# Altium schematic sheet 8-PORT.SchDoc: RD15002_SingleSCT.PrjPcb
size A4; DrawnBy: 邓勇杰; Revision: A1.0.0; SheetNumber: 9; SheetTotal: 10; Time: 2015/12/2
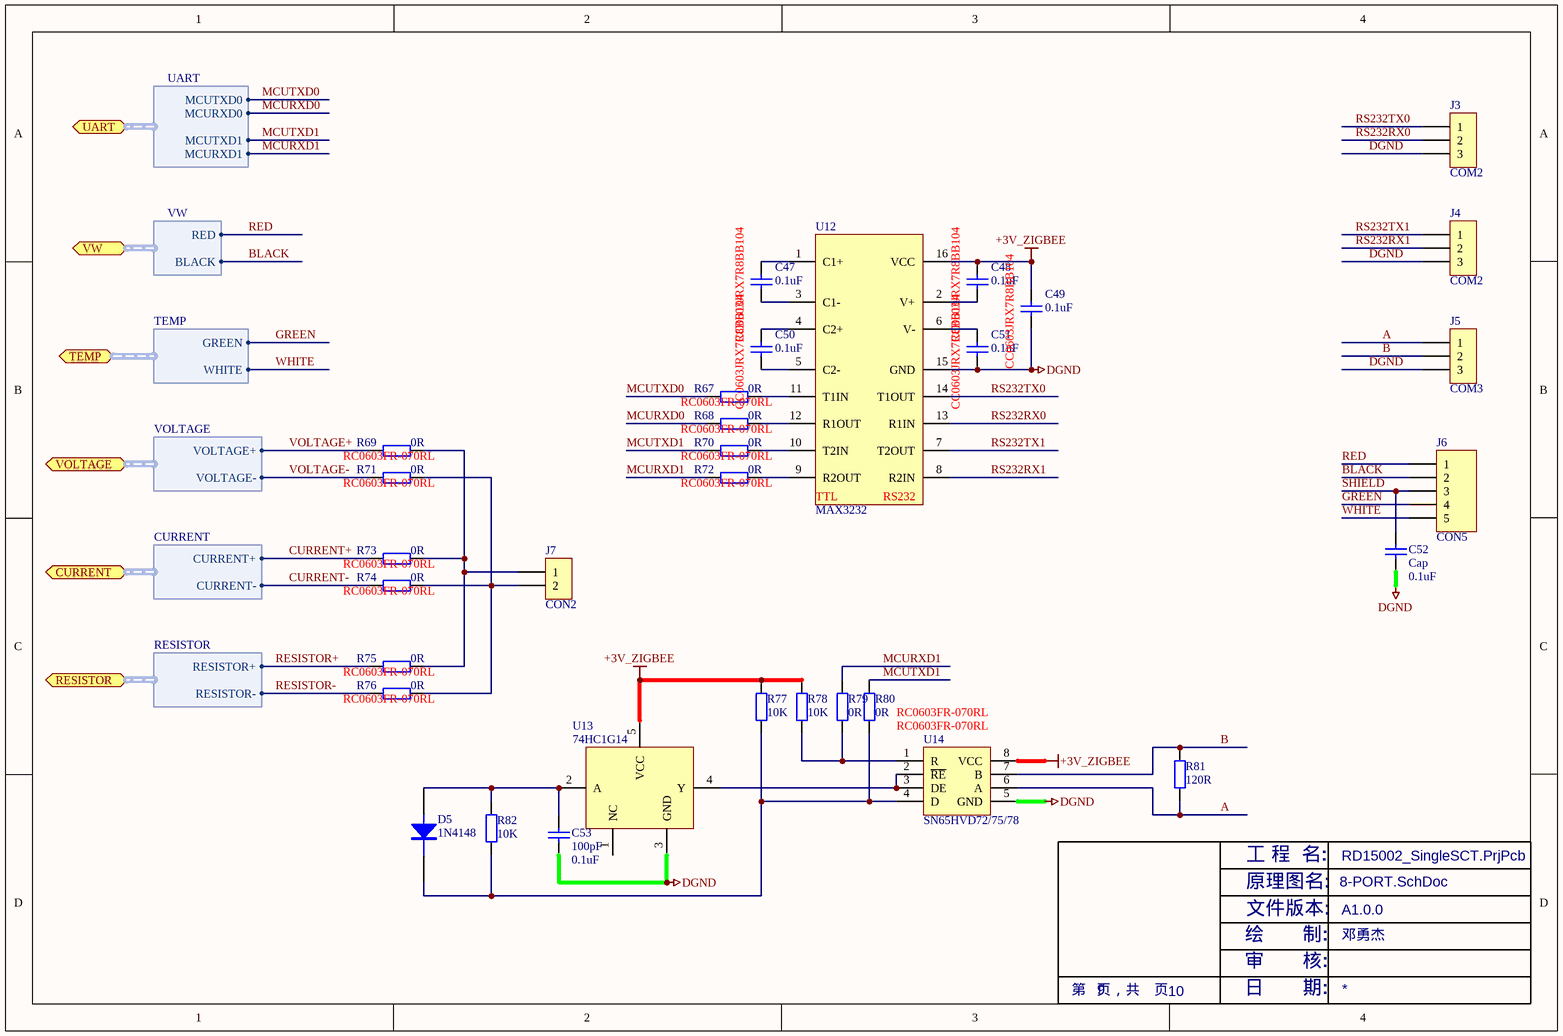
[diagram p0: 8-PORT.SchDoc]

## Parts
C47  0.1uF  Type No.: CC0603JRX7R8BB104  [CC0603]
C48  0.1uF  Type No.: CC0603JRX7R8BB104  [CC0603]
C49  0.1uF  Type No.: CC0603JRX7R8BB104  [CC0603]
C50  0.1uF  Type No.: CC0603JRX7R8BB104  [CC0603]
C51  0.1uF  Type No.: CC0603JRX7R8BB104  [CC0603]
C52  Cap  value 0.1uF  [CC0603]
C53  100pF  value 0.1uF  [CC0603]
D5  1N4148  [SOD323]
J3  COM2  [ECH350H-3P]
J4  COM2  [ECH350H-3P]
J5  COM3  [ECH350H-3P]
J6  CON5  [ECH350H-5P]
J7  CON2  [ECH350H-2P]
R67  0R  Type No.: RC0603FR-070RL  [CC0603]
R68  0R  Type No.: RC0603FR-070RL  [CC0603]
R69  0R  Type No.: RC0603FR-070RL  [CC0603]
R70  0R  Type No.: RC0603FR-070RL  [CC0603]
R71  0R  Type No.: RC0603FR-070RL  [CC0603]
R72  0R  Type No.: RC0603FR-070RL  [CC0603]
R73  0R  Type No.: RC0603FR-070RL  [CC0603]
R74  0R  Type No.: RC0603FR-070RL  [CC0603]
R75  0R  Type No.: RC0603FR-070RL  [CC0603]
R76  0R  Type No.: RC0603FR-070RL  [CC0603]
R77  10K  [CC0603]
R78  10K  [CC0603]
R79  0R  Type No.: RC0603FR-070RL  [CC0603]
R80  0R  Type No.: RC0603FR-070RL  [CC0603]
R81  120R  [CC0603]
R82  10K  [CC0603]
U12  MAX3232  [SO-16]
U13  74HC1G14  [SOT-23-5]
U14  SN65HVD72/75/78  [SO-8]

## Ports
CURRENT (harness CURRENT), RESISTOR (harness RESISTOR), TEMP (harness TEMP), UART (harness UART), VOLTAGE (harness VOLTAGE), VW (harness VW)

## Harnesses
UART: MCUTXD0, MCUTXD1, MCURXD0, MCURXD1
VW: RED, BLACK
TEMP: GREEN, WHITE
VOLTAGE: VOLTAGE+, VOLTAGE-
CURRENT: CURRENT+, CURRENT-
RESISTOR: RESISTOR+, RESISTOR-

## Nets
+3V_ZIGBEE: C48.2 C49.2 R77.2 R78.1 U12.16(VCC) U13.5(VCC) U14.8(VCC)
DGND: C49.1 C51.1 C52.1 C53.1 J3.3 J4.3 J5.3 U12.15(GND) U13.3(GND) U14.5(GND)
A: J5.1 R81.1 U14.6(A)
B: J5.2 R81.2 U14.7(B)
BLACK: J6.2 ; port VW.BLACK
CURRENT+: R73.2 ; port CURRENT.CURRENT+
CURRENT-: R74.2 ; port CURRENT.CURRENT-
GREEN: J6.4 ; port TEMP.GREEN
MCURXD0: R68.2 ; port UART.MCURXD0
MCURXD1: R72.2 R79.1 ; port UART.MCURXD1
MCUTXD0: R67.2 ; port UART.MCUTXD0
MCUTXD1: R70.2 R80.1 ; port UART.MCUTXD1
RED: J6.1 ; port VW.RED
RESISTOR+: R75.2 ; port RESISTOR.RESISTOR+
RESISTOR-: R76.2 ; port RESISTOR.RESISTOR-
RS232RX0: J3.2 U12.13(R1IN)
RS232RX1: J4.2 U12.8(R2IN)
RS232TX0: J3.1 U12.14(T1OUT)
RS232TX1: J4.1 U12.7(T2OUT)
SHIELD: C52.2 J6.3
VOLTAGE+: R69.2 ; port VOLTAGE.VOLTAGE+
VOLTAGE-: R71.2 ; port VOLTAGE.VOLTAGE-
WHITE: J6.5 ; port TEMP.WHITE
NetC47_1: C47.1 U12.3(C1-)
NetC47_2: C47.2 U12.1(C1+)
NetC48_1: C48.1 U12.2(V+)
NetC50_1: C50.1 U12.5(C2-)
NetC50_2: C50.2 U12.4(C2+)
NetC51_2: C51.2 U12.6(V-)
NetC53_2: C53.2 D5.1(A) R82.2 U13.2(A)
NetD5_2: D5.2(K) R77.1 R80.2 R82.1 U14.4(D)
NetJ7_1: J7.1 R69.1 R73.1 R75.1
NetJ7_2: J7.2 R71.1 R74.1 R76.1
NetR67_1: R67.1 U12.11(T1IN)
NetR68_1: R68.1 U12.12(R1OUT)
NetR70_1: R70.1 U12.10(T2IN)
NetR72_1: R72.1 U12.9(R2OUT)
NetR78_2: R78.2 R79.2 U14.1(R)
NetU13_4: U13.4(Y) U14.2(~{RE}) U14.3(DE)

Not connected (* = marked no-connect by the designer): U13 1(NC)

## Notes on the sheet
- 文件版本:
- 原理图名:
- 工 程  名:
- 绘       制:
- 审       核:
- 第   页，共    页
- 日       期:
- (in symbol MAX3232) TTL; RS232

## Library data of the parts
C47-C53 = Cap: Capacitor
  C52 C53: Published: 8-Jun-2000; LatestRevisionDate: 17-Jul-2002; LatestRevisionNote: Re-released for DXP Platform.; PackageReference: RAD-0.3; Publisher: Altium Limited; PackageDescription: Radial Cap, Thru-Hole; 2 Leads; 0.3 in Pin Spacing
D5 = DIODE
J3-J5 = SIP3: jointbar
J6 = Header 5: Header, 5-Pin; LatestRevisionDate: 17-Jul-2002; LatestRevisionNote: Re-released for DXP Platform.; Publisher: Altium Limited
J7 = SIP2: jointbar
R67-R76 R79 R80 = Res2: Resistor
R77 R78 R81 R82 = Res2: Resistor; Value: 1K; Published: 8-Jun-2000; LatestRevisionDate: 17-Jul-2002; LatestRevisionNote: Re-released for DXP Platform.; PackageReference: AXIAL-0.4; Publisher: Altium Limited
U12 = MAX3232: communication  IC